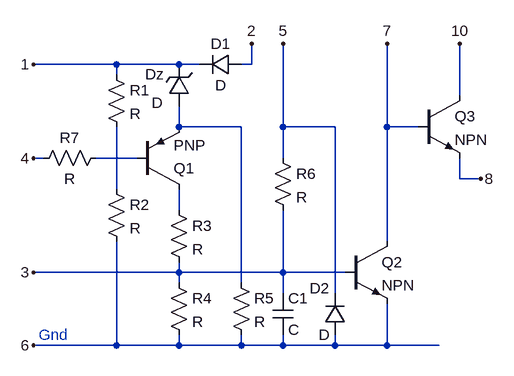
[diagram p0: schematic Stk73410.asc]
Stk73410.asc, the LTspice schematic file:
Version 4
SHEET 1 880 680
WIRE -64 -64 -192 -64
WIRE 32 -64 -64 -64
WIRE 64 -64 32 -64
WIRE 144 -64 144 -96
WIRE 144 -64 128 -64
WIRE -64 -48 -64 -64
WIRE 464 -16 464 -96
WIRE 32 32 32 0
WIRE 128 32 32 32
WIRE 192 32 192 -96
WIRE 272 32 192 32
WIRE 352 32 352 -96
WIRE 400 32 352 32
WIRE -176 80 -192 80
WIRE -32 80 -96 80
WIRE 192 80 192 32
WIRE 464 112 464 80
WIRE 496 112 464 112
WIRE -64 128 -64 32
WIRE 32 160 32 128
WIRE 352 208 352 32
WIRE 32 256 32 240
WIRE 32 256 -192 256
WIRE 192 256 192 160
WIRE 192 256 32 256
WIRE 288 256 192 256
WIRE 32 272 32 256
WIRE 128 272 128 32
WIRE 192 288 192 256
WIRE 272 288 272 32
WIRE -64 368 -64 208
WIRE -64 368 -192 368
WIRE 32 368 32 352
WIRE 32 368 -64 368
WIRE 128 368 128 352
WIRE 128 368 32 368
WIRE 192 368 192 352
WIRE 192 368 128 368
WIRE 272 368 272 352
WIRE 272 368 192 368
WIRE 352 368 352 304
WIRE 352 368 272 368
WIRE 432 368 352 368
FLAG -192 80 4
FLAG -192 -64 1
FLAG 144 -96 2
FLAG 192 -96 5
FLAG -192 256 3
FLAG -192 368 6
FLAG 352 -96 7
FLAG 464 -96 10
FLAG 496 112 8
SYMBOL pnp2 -32 128 M180
SYMATTR InstName Q1
SYMBOL npn2 288 208 R0
SYMATTR InstName Q2
SYMBOL res -80 -64 R0
SYMATTR InstName R1
SYMBOL res -80 112 R0
SYMATTR InstName R2
SYMBOL res 16 144 R0
SYMATTR InstName R3
SYMBOL res 16 256 R0
SYMATTR InstName R4
SYMBOL res 112 256 R0
SYMATTR InstName R5
SYMBOL zener 48 0 R180
WINDOW 0 39 49 Left 0
WINDOW 3 41 5 Left 0
SYMATTR InstName Dz
SYMBOL diode 128 -80 R90
WINDOW 0 0 32 VBottom 0
WINDOW 3 32 32 VTop 0
SYMATTR InstName D1
SYMBOL diode 288 352 R180
WINDOW 0 24 72 Left 0
WINDOW 3 24 0 Left 0
SYMATTR InstName D2
SYMBOL res 176 64 R0
SYMATTR InstName R6
SYMBOL cap 176 288 R0
SYMATTR InstName C1
SYMBOL res -80 64 R90
WINDOW 0 0 56 VBottom 0
WINDOW 3 32 56 VTop 0
SYMATTR InstName R7
SYMBOL npn2 400 -16 R0
SYMATTR InstName Q3
TEXT -184 352 Left 0 ;Gnd

The netlist it stands for:
* Stk73410.asc
Q1 N004 N002 N001 0 PNP
Q2 7 3 6 0 NPN
R1 1 N003 R
R2 N003 6 R
R3 N004 3 R
R4 3 6 R
R5 N001 6 R
Dz N001 1 D
D1 2 1 D
D2 6 5 D
R6 5 3 R
C1 3 6 C
R7 N002 4 R
Q3 10 7 8 0 NPN
.model D D
.lib standard.dio
.model NPN NPN
.model PNP PNP
.lib standard.bjt
* Gnd
.backanno
.end